# Altium schematic sheet Revision_History.SchDoc
size A4; DocumentNumber: 5; SheetNumber: 5; SheetTotal: 6; PageSetup: Record=PageOptions|CenterHorizontal=True|CenterVertical=True|PrintScale=0.73|XCorrection=1.00|YCorrection=1.00|PrintKind=0|BorderSize=5000000|LeftOffset=0|BottomOffset=0|Orientation=2|PaperLength=1000|PaperWidth=1000|Scale=100|PaperSource=7|PrintQuality=-4|MediaType=1|DitherType=10|PaperKind=A4|PrintScaleMode=1; sheetTitle: Revision history
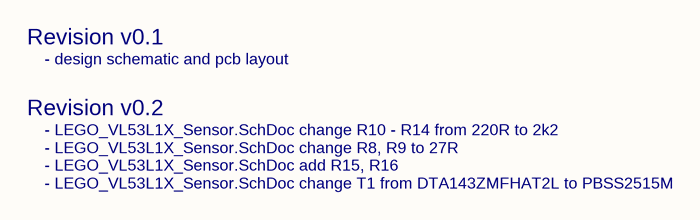
[diagram p0: Revision_History.SchDoc]

## Notes on the sheet
- Revision v0.1
- - design schematic and pcb layout
- Revision v0.2
- - LEGO_VL53L1X_Sensor.SchDoc change R10 - R14 from 220R to 2k2
- - LEGO_VL53L1X_Sensor.SchDoc change R8, R9 to 27R
- - LEGO_VL53L1X_Sensor.SchDoc add R15, R16
- - LEGO_VL53L1X_Sensor.SchDoc change T1 from DTA143ZMFHAT2L to PBSS2515M
- Title:
- Size:
- Date:
- A4
- Number:
- Time:
- Revision:
- Sheet
- of
- Autor:
- Project:
- File: